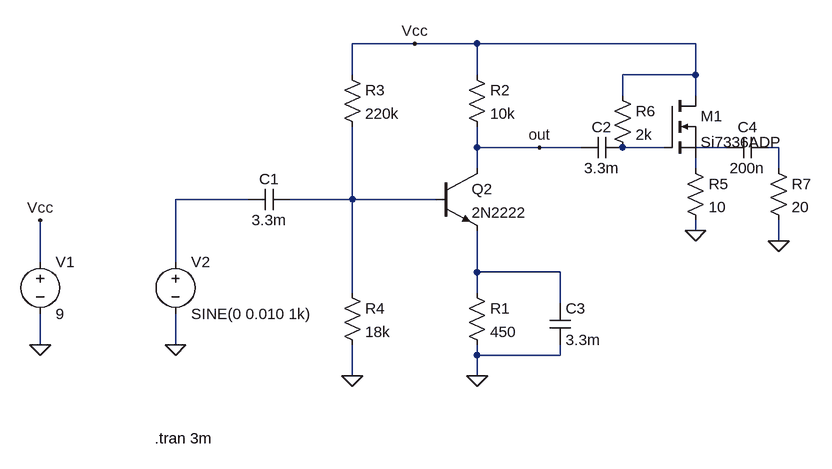
[diagram p0: schematic Draft1.asc]
Draft1.asc, the LTspice schematic file:
Version 4
SHEET 1 928 680
WIRE 288 32 192 32
WIRE 384 32 288 32
WIRE 720 32 384 32
WIRE 192 80 192 32
WIRE 384 80 384 32
WIRE 720 80 720 32
WIRE 720 80 608 80
WIRE 608 112 608 80
WIRE 720 112 720 80
WIRE 384 192 384 160
WIRE 480 192 384 192
WIRE 544 192 480 192
WIRE 608 192 592 192
WIRE 672 192 608 192
WIRE 768 192 720 192
WIRE 848 192 832 192
WIRE 384 224 384 192
WIRE 720 224 720 208
WIRE 848 224 848 192
WIRE 32 272 -80 272
WIRE 192 272 192 160
WIRE 192 272 96 272
WIRE 320 272 192 272
WIRE 720 320 720 304
WIRE 848 336 848 304
WIRE -288 368 -288 304
WIRE -80 368 -80 272
WIRE 384 384 384 320
WIRE 512 384 384 384
WIRE 192 416 192 272
WIRE 384 416 384 384
WIRE 512 432 512 384
WIRE -288 496 -288 448
WIRE -80 496 -80 448
WIRE 384 512 384 496
WIRE 512 512 512 496
WIRE 512 512 384 512
WIRE 192 544 192 496
WIRE 384 544 384 512
FLAG 384 544 0
FLAG 192 544 0
FLAG 480 192 out
FLAG -288 496 0
FLAG -288 304 Vcc
FLAG 288 32 Vcc
FLAG -80 496 0
FLAG 720 320 0
FLAG 848 336 0
SYMBOL npn 320 224 R0
SYMATTR InstName Q2
SYMATTR Value 2N2222
SYMBOL Res 368 400 R0
SYMATTR InstName R1
SYMATTR Value 450
SYMBOL Res 368 64 R0
SYMATTR InstName R2
SYMATTR Value 10k
SYMBOL Res 176 64 R0
SYMATTR InstName R3
SYMATTR Value 220k
SYMBOL Res 176 400 R0
SYMATTR InstName R4
SYMATTR Value 18k
SYMBOL Cap 96 256 R90
WINDOW 0 0 32 VBottom 2
WINDOW 3 32 32 VTop 2
SYMATTR InstName C1
SYMATTR Value 3.3m
SYMBOL Voltage -288 352 R0
SYMATTR InstName V1
SYMATTR Value 9
SYMBOL Voltage -80 352 R0
SYMATTR InstName V2
SYMATTR Value SINE(0 0.010 1k)
SYMBOL Cap 608 176 R90
WINDOW 0 0 32 VBottom 2
WINDOW 3 32 32 VTop 2
SYMATTR InstName C2
SYMATTR Value 3.3m
SYMBOL Cap 496 432 R0
SYMATTR InstName C3
SYMATTR Value 3.3m
SYMBOL nmos 672 112 R0
SYMATTR InstName M1
SYMATTR Value Si7336ADP
SYMBOL Res 704 208 R0
SYMATTR InstName R5
SYMATTR Value 10
SYMBOL Res 592 96 R0
SYMATTR InstName R6
SYMATTR Value 2k
SYMBOL Res 832 208 R0
SYMATTR InstName R7
SYMATTR Value 20
SYMBOL Cap 832 176 R90
WINDOW 0 0 32 VBottom 2
WINDOW 3 32 32 VTop 2
SYMATTR InstName C4
SYMATTR Value 200n
TEXT -112 640 Left 2 !.tran 3m

The netlist it stands for:
* Draft1.asc
Q2 out N006 N007 0 2N2222
R1 N007 0 450
R2 Vcc out 10k
R3 Vcc N006 220k
R4 N006 0 18k
C1 N006 N005 3.3m
V1 Vcc 0 9
V2 N005 0 SINE(0 0.010 1k)
C2 N001 out 3.3m
C3 N007 0 3.3m
M1 Vcc N001 N004 N004 Si7336ADP
R5 N004 0 10
R6 Vcc N001 2k
R7 N003 0 20
C4 N003 N002 200n
.model NPN NPN
.model PNP PNP
.lib standard.bjt
.model NMOS NMOS
.model PMOS PMOS
.lib standard.mos
.tran 3m
.backanno
.end